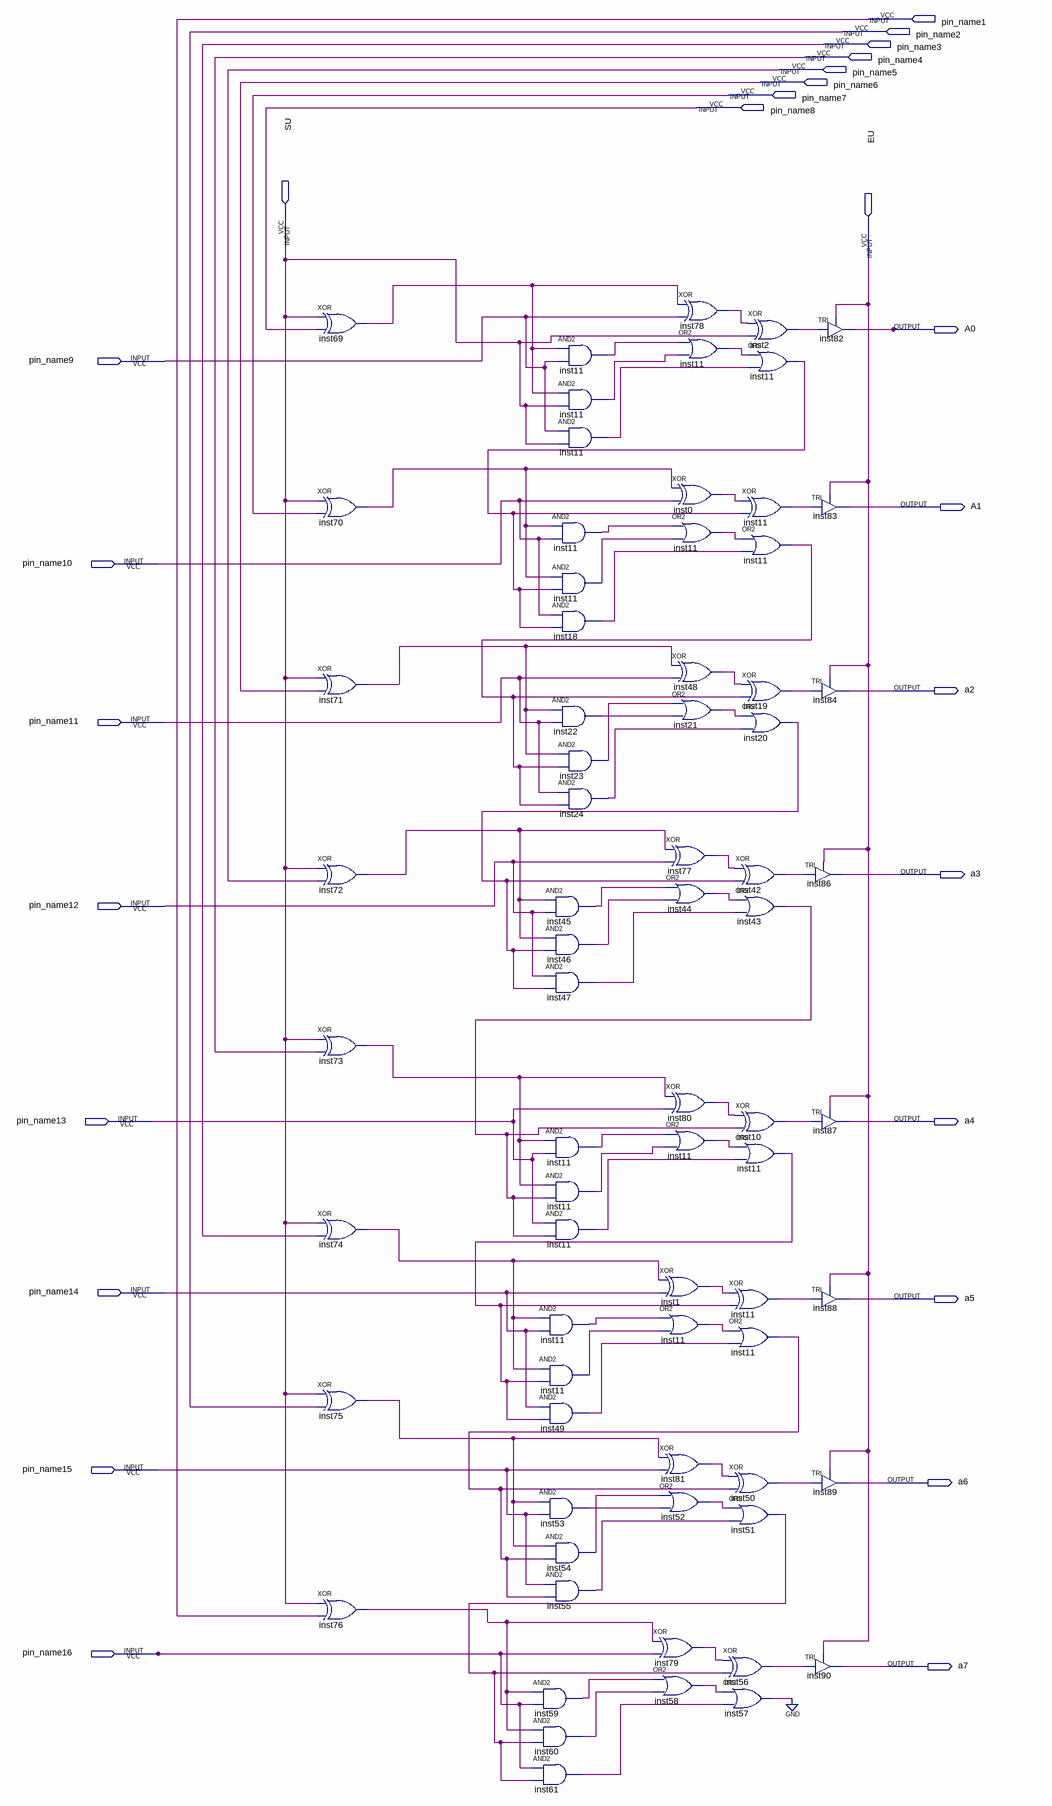
[diagram p0: schematic sheet]
// Quartus schematic Figura12_Somador_Subtrador_Acumulador.bdf as structural Verilog: 72 symbols, 26 pins
module Figura12_Somador_Subtrador_Acumulador (
  input  pin_name1,
  input  pin_name2,
  input  pin_name3,
  input  pin_name4,
  input  pin_name5,
  input  pin_name6,
  input  pin_name7,
  input  pin_name8,
  input  SU,
  input  EU,
  input  pin_name9,
  input  pin_name10,
  input  pin_name11,
  input  pin_name12,
  input  pin_name13,
  input  pin_name14,
  input  pin_name15,
  input  pin_name16,
  output A0,
  output A1,
  output a2,
  output a3,
  output a4,
  output a5,
  output a6,
  output a7
);

  wire inst0_out, inst1_out, inst2_out, inst10_out, inst11_out, inst11_out_2, inst11_out_3, inst11_out_4,
       inst11_out_5, inst11_out_6, inst11_out_7, inst11_out_8, inst11_out_9, inst11_out_10, inst11_out_11,
       inst11_out_12, inst11_out_13, inst11_out_14, inst11_out_15, inst11_out_16, inst11_out_17,
       inst11_out_18, inst11_out_19, inst11_out_20, inst18_out, inst19_out, inst20_out, inst21_out,
       inst22_out, inst23_out, inst24_out, inst42_out, inst43_out, inst44_out, inst45_out, inst46_out,
       inst47_out, inst48_out, inst49_out, inst50_out, inst51_out, inst52_out, inst53_out, inst54_out,
       inst55_out, inst56_out, inst57_out, inst58_out, inst59_out, inst60_out, inst61_out, inst69_out,
       inst70_out, inst71_out, inst72_out, inst73_out, inst74_out, inst75_out, inst76_out, inst77_out,
       inst78_out, inst79_out, inst80_out, inst81_out;

  xor inst69 (inst69_out, SU, pin_name8);
  xor inst70 (inst70_out, SU, pin_name7);
  xor inst71 (inst71_out, SU, pin_name6);
  xor inst72 (inst72_out, SU, pin_name5);
  xor inst73 (inst73_out, SU, pin_name4);
  xor inst74 (inst74_out, SU, pin_name3);
  xor inst75 (inst75_out, SU, pin_name2);
  xor inst76 (inst76_out, SU, pin_name1);
  and inst11 (inst11_out_6, inst69_out, pin_name9);
  and inst11_dup2 (inst11_out_7, inst69_out, SU);
  and inst11_dup3 (inst11_out, pin_name9, SU);
  and inst11_dup4 (inst11_out_4, inst70_out, pin_name10);
  and inst11_dup5 (inst11_out_5, inst70_out, inst11_out_15);
  and inst18 (inst18_out, pin_name10, inst11_out_15);
  and inst22 (inst22_out, inst71_out, pin_name11);
  and inst23 (inst23_out, inst71_out, inst11_out_16);
  and inst24 (inst24_out, pin_name11, inst11_out_16);
  and inst45 (inst45_out, inst72_out, pin_name12);
  and inst46 (inst46_out, inst72_out, inst20_out);
  and inst47 (inst47_out, pin_name12, inst20_out);
  and inst11_dup6 (inst11_out_13, inst73_out, pin_name13);
  and inst11_dup7 (inst11_out_14, inst73_out, inst43_out);
  and inst11_dup8 (inst11_out_8, pin_name13, inst43_out);
  and inst11_dup9 (inst11_out_11, inst74_out, pin_name14);
  and inst11_dup10 (inst11_out_12, inst74_out, inst11_out_17);
  and inst49 (inst49_out, pin_name14, inst11_out_17);
  and inst53 (inst53_out, inst75_out, pin_name15);
  and inst54 (inst54_out, inst75_out, inst11_out_18);
  and inst55 (inst55_out, pin_name15, inst11_out_18);
  and inst59 (inst59_out, inst76_out, pin_name16);
  and inst60 (inst60_out, inst76_out, inst51_out);
  and inst61 (inst61_out, pin_name16, inst51_out);
  xor inst0 (inst0_out, inst70_out, pin_name10);
  or inst11_dup11 (inst11_out_3, inst11_out_4, inst11_out_5);
  xor inst48 (inst48_out, inst71_out, pin_name11);
  or inst21 (inst21_out, inst23_out, inst22_out);
  xor inst77 (inst77_out, inst72_out, pin_name12);
  or inst44 (inst44_out, inst45_out, inst46_out);
  xor inst80 (inst80_out, inst73_out, pin_name13);
  or inst11_dup12 (inst11_out_9, inst11_out_13, inst11_out_14);
  xor inst1 (inst1_out, inst74_out, pin_name14);
  or inst11_dup13 (inst11_out_10, inst11_out_11, inst11_out_12);
  xor inst81 (inst81_out, inst75_out, pin_name15);
  or inst52 (inst52_out, inst54_out, inst53_out);
  xor inst79 (inst79_out, inst76_out, pin_name16);
  or inst58 (inst58_out, inst59_out, inst60_out);
  xor inst78 (inst78_out, inst69_out, pin_name9);
  or inst11_dup14 (inst11_out_2, inst11_out_6, inst11_out_7);
  xor inst56 (inst56_out, inst79_out, inst51_out);
  or inst57 (inst57_out, inst58_out, inst61_out);
  xor inst2 (inst2_out, inst78_out, SU);
  or inst11_dup15 (inst11_out_15, inst11_out_2, inst11_out);
  xor inst11_dup16 (inst11_out_19, inst0_out, inst11_out_15);
  or inst11_dup17 (inst11_out_16, inst11_out_3, inst18_out);
  xor inst19 (inst19_out, inst48_out, inst11_out_16);
  or inst20 (inst20_out, inst21_out, inst24_out);
  xor inst42 (inst42_out, inst77_out, inst20_out);
  or inst43 (inst43_out, inst44_out, inst47_out);
  xor inst10 (inst10_out, inst80_out, inst43_out);
  or inst11_dup18 (inst11_out_17, inst11_out_9, inst11_out_8);
  xor inst11_dup19 (inst11_out_20, inst1_out, inst11_out_17);
  or inst11_dup20 (inst11_out_18, inst11_out_10, inst49_out);
  xor inst50 (inst50_out, inst81_out, inst11_out_18);
  or inst51 (inst51_out, inst52_out, inst55_out);
  TRI inst82 (.IN(inst2_out), .OE(EU), .OUT(A0));
  TRI inst83 (.IN(inst11_out_19), .OE(EU), .OUT(A1));
  TRI inst84 (.IN(inst19_out), .OE(EU), .OUT(a2));
  TRI inst86 (.IN(inst42_out), .OE(EU), .OUT(a3));
  TRI inst87 (.IN(inst10_out), .OE(EU), .OUT(a4));
  TRI inst88 (.IN(inst11_out_20), .OE(EU), .OUT(a5));
  TRI inst89 (.IN(inst50_out), .OE(EU), .OUT(a6));
  TRI inst90 (.IN(inst56_out), .OE(EU), .OUT(a7));
  // also tied to GND on the sheet: inst57_out
endmodule
